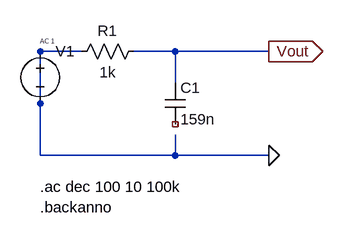
[diagram p0: schematic rc_lowpass.asc]
rc_lowpass.asc, the LTspice schematic file:
Version 4
SHEET 1 880 680
WIRE 112 160 48 160
WIRE 256 160 192 160
WIRE 400 160 256 160
WIRE 256 208 256 160
WIRE 256 320 256 288
WIRE 48 320 48 160
WIRE 48 320 256 320
WIRE 256 320 400 320
FLAG 400 160 Vout
FLAG 400 320 0
IOPIN 400 160 Out
SYMBOL voltage 48 144 R0
WINDOW 123 0 0 Left 0
WINDOW 39 0 0 Left 0
SYMATTR InstName V1
SYMATTR Value ""
SYMATTR Value2 AC 1
SYMBOL res 208 144 R90
WINDOW 0 0 56 VBottom 2
WINDOW 3 32 56 VTop 2
SYMATTR InstName R1
SYMATTR Value 1k
SYMBOL cap 240 208 R0
SYMATTR InstName C1
SYMATTR Value 159n
TEXT 48 368 Left 2 !.ac dec 100 10 100k
TEXT 48 400 Left 2 !.backanno

The netlist it stands for:
* rc_lowpass.asc
V1 0 0 AC 1
R1 Vout 0 1k
C1 Vout NC_01 159n
.ac dec 100 10 100k
.backanno
.backanno
.end